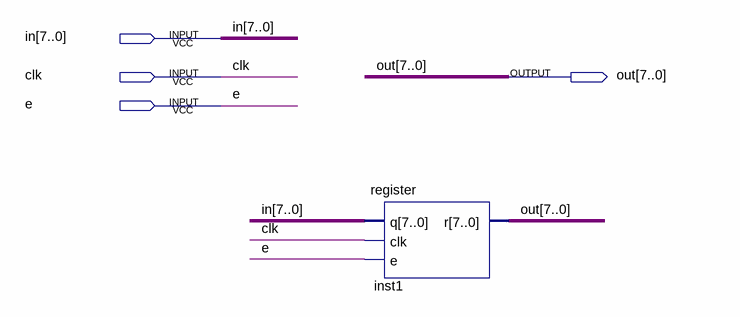
[diagram p0: schematic sheet]
// Quartus schematic pc.bdf as structural Verilog: 1 symbols, 4 pins
module pc (
  input  [7:0] in,
  input  clk,
  input  e,
  output [7:0] out
);

  register inst1 (.q(in), .clk(clk), .e(e), .r(out));
endmodule
